# Altium schematic sheet 10_MeasOutUI.SchDoc
size A4; Organization: OLTEST; Revision: 01; SheetNumber: 10; SheetTotal: 13; Название листа: Название листа; Разработчик: Бондарчук С.; Прибор: R100; АМАК.000000.000 Э3: R100.230.030.000-00; Дата: 16.04.2019; Формат: A4; workspacename: R100_Boards_v1
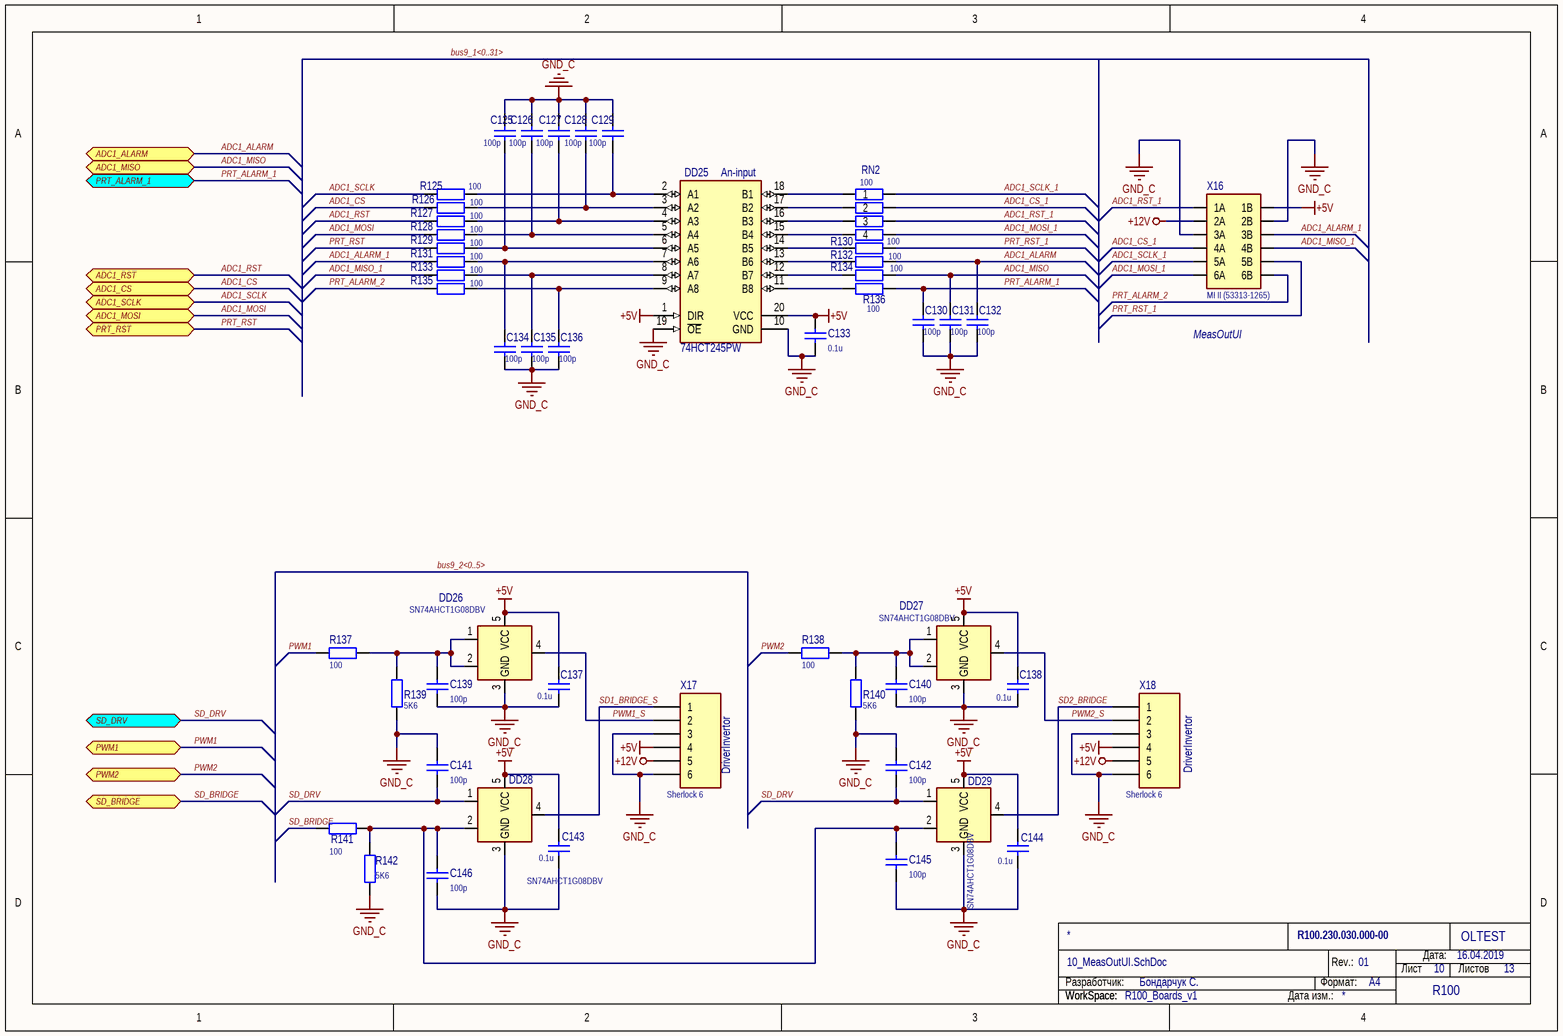
[diagram p0: 10_MeasOutUI.SchDoc]

## Parts
C125  100p  [SMD_C_0603]
C126  100p  [SMD_C_0603]
C127  100p  [SMD_C_0603]
C128  100p  [SMD_C_0603]
C129  100p  [SMD_C_0603]
C130  100p  [SMD_C_0603]
C131  100p  [SMD_C_0603]
C132  100p  [SMD_C_0603]
C133  0.1u  [SMD_C_0603]
C134  100p  [SMD_C_0603]
C135  100p  [SMD_C_0603]
C136  100p  [SMD_C_0603]
C137  0.1u  [SMD_C_0603]
C138  0.1u  [SMD_C_0603]
C139  100p  [SMD_C_0603]
C140  100p  [SMD_C_0603]
C141  100p  [SMD_C_0603]
C142  100p  [SMD_C_0603]
C143  0.1u  [SMD_C_0603]
C144  0.1u  [SMD_C_0603]
C145  100p  [SMD_C_0603]
C146  100p  [SMD_C_0603]
DD25  74HCT245PW  [TSSOP20]
DD26  SN74AHCT1G08DBV  [SOT-23(DBV)]
DD27  SN74AHCT1G08DBV  [SOT-23(DBV)]
DD28  SN74AHCT1G08DBV  [SOT-23(DBV)]
DD29  SN74AHCT1G08DBV  [SOT-23(DBV)]
R125  100  [SMD_R_0603]
R126  100  [SMD_R_0603]
R127  100  [SMD_R_0603]
R128  100  [SMD_R_0603]
R129  100  [SMD_R_0603]
R130  100  [SMD_R_0603]
R131  100  [SMD_R_0603]
R132  100  [SMD_R_0603]
R133  100  [SMD_R_0603]
R134  100  [SMD_R_0603]
R135  100  [SMD_R_0603]
R136  100  [SMD_R_0603]
R137  100  [SMD_R_0603]
R138  100  [SMD_R_0603]
R139  5K6  [SMD_R_0603]
R140  5K6  [SMD_R_0603]
R141  100  [SMD_R_0603]
R142  5K6  [SMD_R_0603]
RN2  100  [CRA06S]
X16  MI II (53313-1265)  [53313-1265]
X17  Sherlock 6  [35362-0650]
X18  Sherlock 6  [35362-0650]

## Ports
ADC1_ALARM, ADC1_CS, ADC1_MISO, ADC1_MOSI, ADC1_RST, ADC1_SCLK, PRT_ALARM_1, PRT_RST, PWM1, PWM2, SD_BRIDGE, SD_DRV (bidir)

## Nets
+5V: C133.2 C137.2 C138.2 C143.2 C144.2 DD25.1(DIR) DD25.20(VCC) DD26.5(VCC) DD27.5(VCC) DD28.5(VCC) DD29.5(VCC) X16.1B X17.4 X18.4
+12V: X16.2A X17.5 X18.5
GND_C: C125.1 C126.1 C127.1 C128.1 C129.1 C130.1 C131.1 C132.1 C133.1 C134.1 C135.1 C136.1 C137.1 C138.1 C139.1 C140.1 C141.2 C142.2 C143.1 C144.1 C145.1 C146.1 DD25.10(GND) DD25.19(~{OE}) DD26.3(GND) DD27.3(GND) DD28.3(GND) DD29.3(GND) R139.1 R140.1 R142.1 X16.2B X16.3A X17.3 X17.6 X18.3 X18.6
ADC1_ALARM: C132.2 R132.2 ; port ADC1_ALARM
ADC1_ALARM_1: R131.1 X16.3B
ADC1_CS: R126.1 ; port ADC1_CS
ADC1_CS_1: RN2.7 X16.4A
ADC1_MISO: C131.2 R134.2 ; port ADC1_MISO
ADC1_MISO_1: R133.1 X16.4B
ADC1_MOSI: R128.1 ; port ADC1_MOSI
ADC1_MOSI_1: RN2.5 X16.6A
ADC1_RST: R127.1 ; port ADC1_RST
ADC1_RST_1: RN2.6 X16.1A
ADC1_SCLK: R125.1 ; port ADC1_SCLK
ADC1_SCLK_1: RN2.8 X16.5A
PRT_ALARM_1: C130.2 R136.2 ; port PRT_ALARM_1
PRT_ALARM_2: R135.1 X16.6B
PRT_RST: R129.1 ; port PRT_RST
PRT_RST_1: R130.2 X16.5B
PWM1: R137.1 ; port PWM1
PWM1_S: DD26.4 X17.2
PWM2: R138.1 ; port PWM2
PWM2_S: DD27.4 X18.2
SD1_BRIDGE_S: DD28.4 X17.1
SD2_BRIDGE: DD29.4 X18.1
SD_BRIDGE: R141.1 ; port SD_BRIDGE
SD_DRV: C141.1 C142.1 DD28.1 DD29.1 ; port SD_DRV
NetC125_2: C125.2 DD25.6(A5) R129.2
NetC126_2: C126.2 DD25.5(A4) R128.2
NetC127_2: C127.2 DD25.4(A3) R127.2
NetC128_2: C128.2 DD25.3(A2) R126.2
NetC129_2: C129.2 DD25.2(A1) R125.2
NetC134_2: C134.2 DD25.7(A6) R131.2
NetC135_2: C135.2 DD25.8(A7) R133.2
NetC136_2: C136.2 DD25.9(A8) R135.2
NetC139_2: C139.2 DD26.1 DD26.2 R137.2 R139.2
NetC140_2: C140.2 DD27.1 DD27.2 R138.2 R140.2
NetC145_2: C145.2 C146.2 DD28.2 DD29.2 R141.2 R142.2
NetDD25_11: DD25.11(B8) R136.1
NetDD25_12: DD25.12(B7) R134.1
NetDD25_13: DD25.13(B6) R132.1
NetDD25_14: DD25.14(B5) R130.1
NetDD25_15: DD25.15(B4) RN2.4
NetDD25_16: DD25.16(B3) RN2.3
NetDD25_17: DD25.17(B2) RN2.2
NetDD25_18: DD25.18(B1) RN2.1

## Buses and harness runs
bus bus9_1<0..31>
bus bus9_2<0..5>

## Notes on the sheet
- (near DD25) An-input
- MeasOutUI
- (near X17) DriverInvertor
- (near X18) DriverInvertor
- Разработчик:
- Формат:
- Rev.:
- Лист
- Дата:
- Листов
- WorkSpace:
- Дата изм.:
- (in symbol SN74AHCT1G08DBV) &

## Library data of the parts
C125-C132 C134-C136 C139-C142 C145 C146 = C0603 100p 100V 5%: SMD C 0603 MURATA 100V 5% NP0; PartNumber: GRM1885C2A101JA01; Manufacturer: MURATA; Value: 100p
C133 C137 C138 C143 C144 = C0603 0.1u 50V 10%: SMD C 0603 MURATA 50V 10% X7R; PartNumber: GRM188R71H104K; Manufacturer: MURATA; Value: 0.1u
DD25 = 74HCT245PW: Octal Bus Transceivers With 3-State Outputs, PW0020A; Manufacturer: NXP; PartNumber: 74HCT245PW
DD26-DD29 = SN74AHCT1G08DBV: 2-in AND; Manufacturer: Texas Instruments; PartNumber: SN74AHCT1G08DBV
R125-R138 R141 = R0603 100 1%: SMD R 0603 VISHAY 0.1W 75V 1% 100ppm; PartNumber: CRCW0603100RFK; Manufacturer: VISHAY; Value: 100
R139 R140 R142 = R0603 5K6 1%: SMD R 0603 VISHAY 0.1W 75V 1% 100ppm; PartNumber: CRCW06035K60FK; Manufacturer: VISHAY; Value: 5K6
RN2 = CRA06S 4x100 1%: SMD RESISTOR ARRAY VISHAY 0.063W 50V 1% 100ppm; PartNumber: CRA06S083100RF; Manufacturer: VISHAY; Value: 100
X16 = 53313-1265: MI II 12 (6x2row), 2A 125V 2mm; Manufacturer: MOLEX; PartNumber: 53313-1265
X17 X18 = 35363-0650: Sherlock 6 Side, 2A 125V 2mm; Manufacturer: MOLEX; PartNumber: 35362-0650